# Altium schematic sheet BeetleMeterV1.SchDoc
size 203 x 127 mm; SheetNumber: 1; SheetTotal: 1
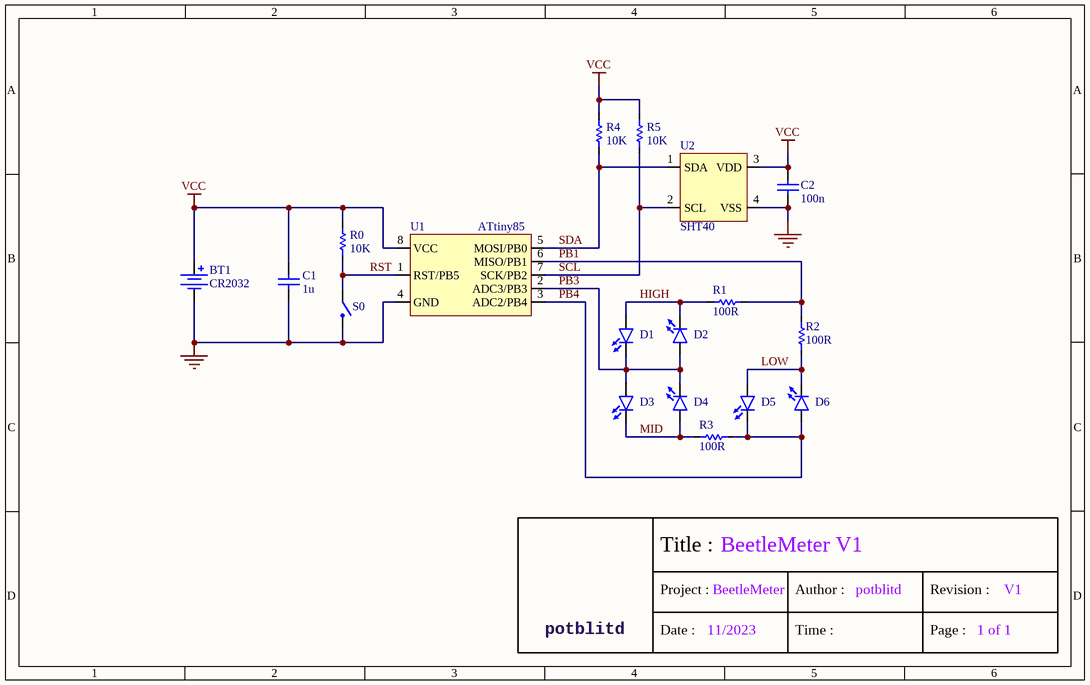
[diagram p0: BeetleMeterV1.SchDoc]

## Parts
BT1  CR2032  [CR2032-TH]
C1  value 1u  [0603C]  (hidden comment: Capacitor)
C2  value 100n  [0603C]  (hidden comment: Capacitor)
D1  R  [0805D]  (value not drawn)
D2  R  [0805D]  (value not drawn)
D3  R  [0805D]  (value not drawn)
D4  R  [0805D]  (value not drawn)
D5  R  [0805D]  (value not drawn)
D6  R  [0805D]  (value not drawn)
R0  value 10K  [0603R]  (hidden comment: Resistor)
R1  value 100R  [0603R]  (hidden comment: Resistor)
R2  value 100R  [0603R]  (hidden comment: Resistor)
R3  value 100R  [0603R]  (hidden comment: Resistor)
R4  value 10K  [0603R]  (hidden comment: Resistor)
R5  value 10K  [0603R]  (hidden comment: Resistor)
S0  (no value)  [SW_6*6]
U1  ATtiny85  [DIP-8 - SMD]
U2  SHT40  [DFN-4-EP(1.5x1.5)]

## Nets
GND: BT1.2(-) C1.1 C2.2 S0.2 U1.4(GND) U2.4(VSS)
VCC: BT1.1(+) C1.2 C2.1 R0.2 R4.2 R5.2 U1.8(VCC) U2.3(VDD)
HIGH: D1.1 D2.2 R1.1
LOW: D5.1 D6.2 R2.1
MID: D3.2 D4.1 R3.2
PB1: R1.2 R2.2 U1.6(MISO/PB1)
PB3: D1.2 D2.1 D3.1 D4.2 U1.2(ADC3/PB3)
PB4: D5.2 D6.1 R3.1 U1.3(ADC2/PB4)
RST: R0.1 S0.1 U1.1(RST/PB5)
SCL: R5.1 U1.7(SCK/PB2) U2.2(SCL)
SDA: R4.1 U1.5(MOSI/PB0) U2.1(SDA)

## Notes on the sheet
- Title :
- BeetleMeter V1
- potblitd
- Project :
- Date :
- 11/2023
- BeetleMeter
- Author :
- Time :
- Revision :
- Page :
- 1 of 1
- V1

## Library data of the parts
BT1 = Battery 3V: Coin cell battery 3V
C1 = Capacitor: Capacitor 1uF; Value: 1uF
C2 = Capacitor: Capacitor 100nF ±10% 50V; Component: CL05B104KB54PNC
D1-D6 = LED: General LED symbol
R0 R4 = Resistor: Resistor 10kΩ ±1% 1/16W; Component: 0402WGF1002TCE; Function: SDA pull-up
R1-R3 = RES: Resistor 100Ω
R5 = Resistor: Resistor 10kΩ ±1% 1/16W; Component: 0402WGF1002TCE; Function: SCL pull-up
S0 = Switch-2: 2-positions switch open-closed
U1 = ATtiny13A-5: tiny AVR 8-pin microcontroller
U2 = SHT40: SHT40 temperature and humidity sensor; Component: SHT40-AD1B-R2; Function: T&H sensor